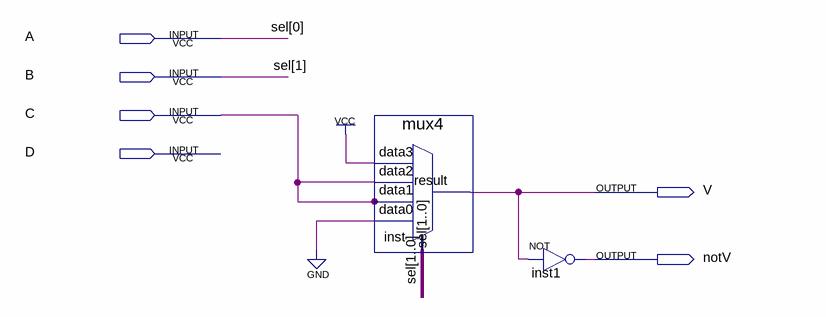
[diagram p0: schematic sheet]
// Quartus schematic c2.bdf as structural Verilog: 2 symbols, 6 pins
module c2 (
  input  A,
  input  B,
  input  C,
  input  D,
  output V,
  output notV
);

  mux4 inst (.data3(1'b1), .data2(C), .data1(C), .data0(1'b0), .sel({B, A}), .result(V));
  not inst1 (notV, V);

  // Other names for the same wires on the sheet: sel[1:0] = {B, A}
endmodule
